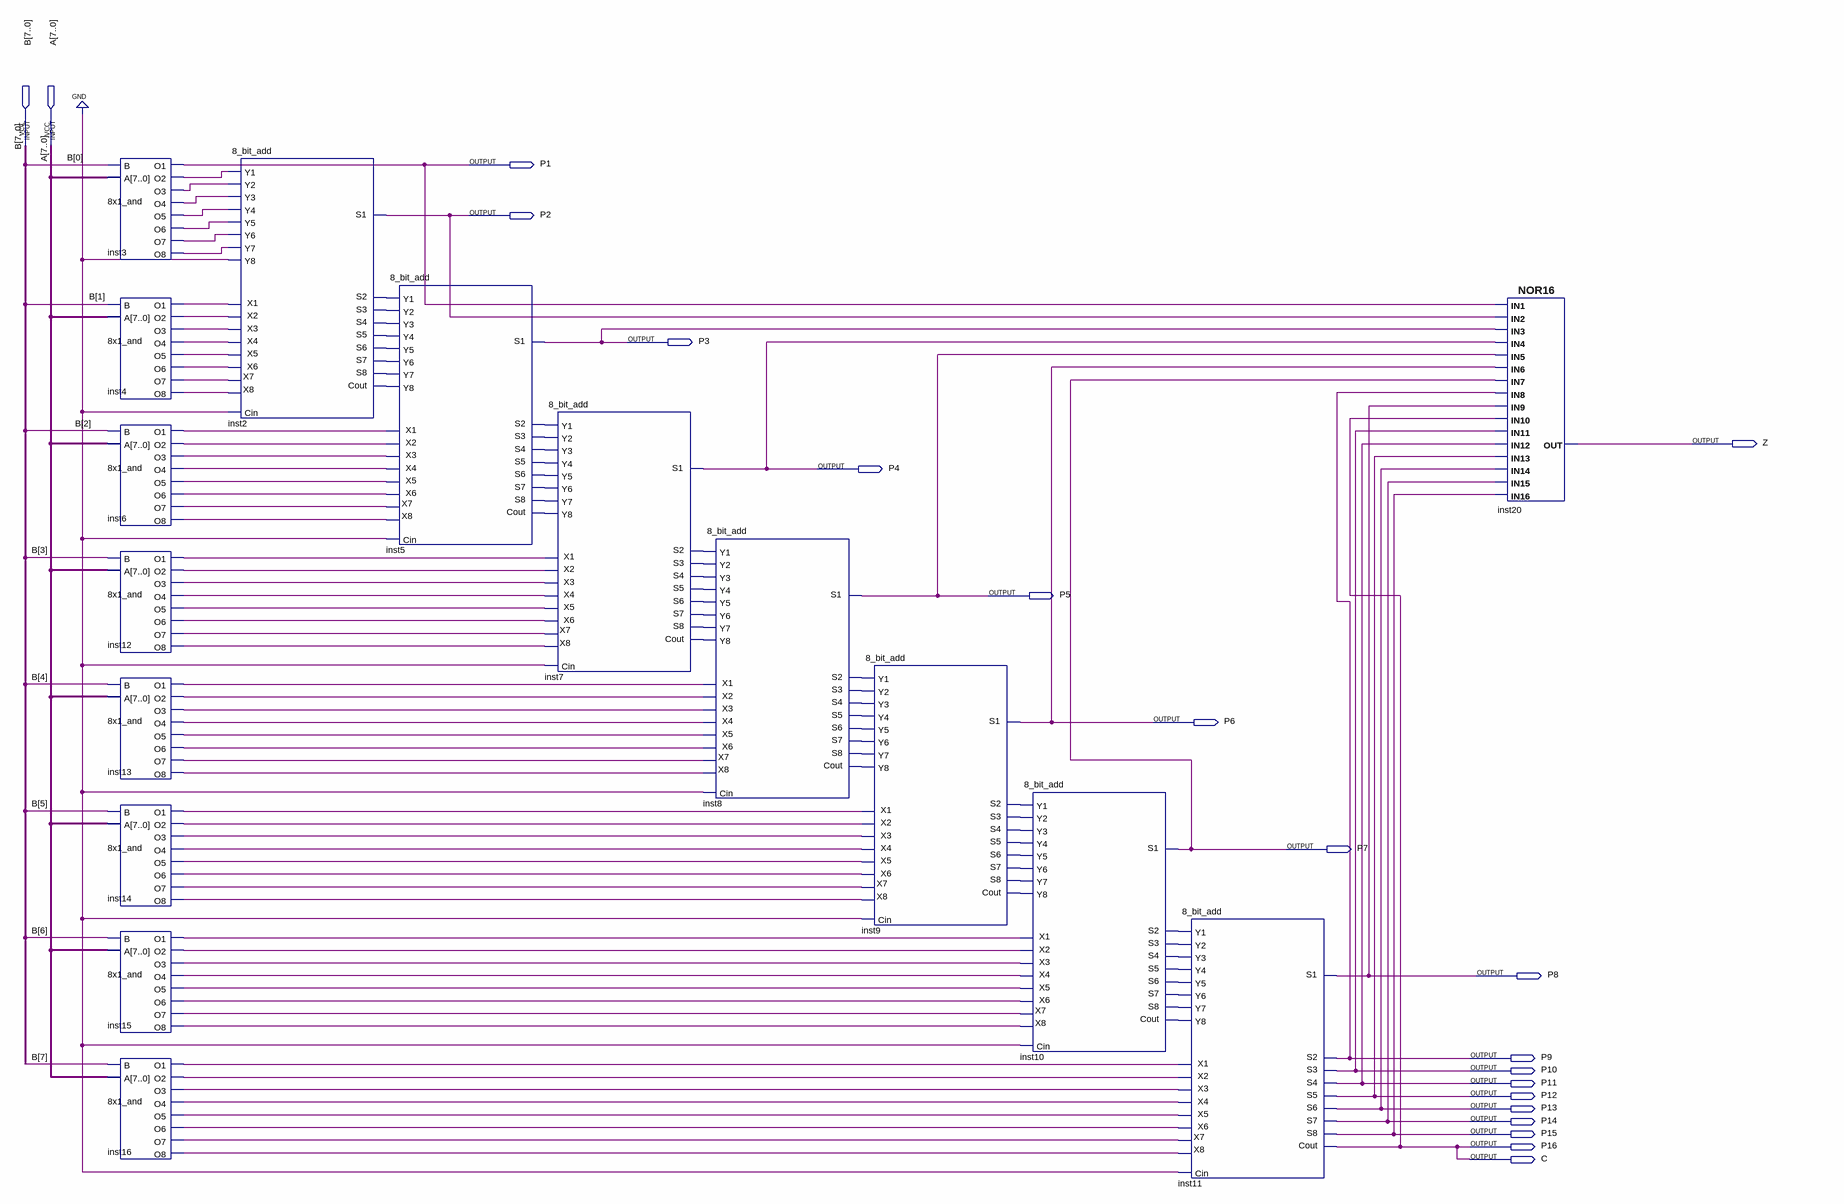
[diagram p0: schematic sheet]
// Quartus schematic MUL_Unsigned.bdf as structural Verilog: 16 symbols, 20 pins
module MUL_Unsigned (
  input  [7:0] B,
  input  [7:0] A,
  output P1,
  output P2,
  output P3,
  output Z,
  output P4,
  output P5,
  output P6,
  output P7,
  output P8,
  output P9,
  output P10,
  output P11,
  output P12,
  output P13,
  output P14,
  output P15,
  output P16,
  output C
);

  wire inst2_cout, inst2_s2, inst2_s3, inst2_s4, inst2_s5, inst2_s6, inst2_s7, inst2_s8, inst3_o2, inst3_o3,
       inst3_o4, inst3_o5, inst3_o6, inst3_o7, inst3_o8, inst4_o1, inst4_o2, inst4_o3, inst4_o4, inst4_o5,
       inst4_o6, inst4_o7, inst4_o8, inst5_cout, inst5_s2, inst5_s3, inst5_s4, inst5_s5, inst5_s6, inst5_s7,
       inst5_s8, inst6_o1, inst6_o2, inst6_o3, inst6_o4, inst6_o5, inst6_o6, inst6_o7, inst6_o8, inst7_cout,
       inst7_s2, inst7_s3, inst7_s4, inst7_s5, inst7_s6, inst7_s7, inst7_s8, inst8_cout, inst8_s2, inst8_s3,
       inst8_s4, inst8_s5, inst8_s6, inst8_s7, inst8_s8, inst9_cout, inst9_s2, inst9_s3, inst9_s4, inst9_s5,
       inst9_s6, inst9_s7, inst9_s8, inst10_cout, inst10_s2, inst10_s3, inst10_s4, inst10_s5, inst10_s6,
       inst10_s7, inst10_s8, inst12_o1, inst12_o2, inst12_o3, inst12_o4, inst12_o5, inst12_o6, inst12_o7,
       inst12_o8, inst13_o1, inst13_o2, inst13_o3, inst13_o4, inst13_o5, inst13_o6, inst13_o7, inst13_o8,
       inst14_o1, inst14_o2, inst14_o3, inst14_o4, inst14_o5, inst14_o6, inst14_o7, inst14_o8, inst15_o1,
       inst15_o2, inst15_o3, inst15_o4, inst15_o5, inst15_o6, inst15_o7, inst15_o8, inst16_o1, inst16_o2,
       inst16_o3, inst16_o4, inst16_o5, inst16_o6, inst16_o7, inst16_o8;

  \8x1_and  inst3 (
    .B(B[0]), .A(A), .O1(P1), .O2(inst3_o2), .O3(inst3_o3), .O4(inst3_o4), .O5(inst3_o5), .O6(inst3_o6),
    .O7(inst3_o7), .O8(inst3_o8));
  \8x1_and  inst4 (
    .B(B[1]), .A(A), .O1(inst4_o1), .O2(inst4_o2), .O3(inst4_o3), .O4(inst4_o4), .O5(inst4_o5),
    .O6(inst4_o6), .O7(inst4_o7), .O8(inst4_o8));
  \8x1_and  inst6 (
    .B(B[2]), .A(A), .O1(inst6_o1), .O2(inst6_o2), .O3(inst6_o3), .O4(inst6_o4), .O5(inst6_o5),
    .O6(inst6_o6), .O7(inst6_o7), .O8(inst6_o8));
  \8x1_and  inst12 (
    .B(B[3]), .A(A), .O1(inst12_o1), .O2(inst12_o2), .O3(inst12_o3), .O4(inst12_o4), .O5(inst12_o5),
    .O6(inst12_o6), .O7(inst12_o7), .O8(inst12_o8));
  \8x1_and  inst13 (
    .B(B[4]), .A(A), .O1(inst13_o1), .O2(inst13_o2), .O3(inst13_o3), .O4(inst13_o4), .O5(inst13_o5),
    .O6(inst13_o6), .O7(inst13_o7), .O8(inst13_o8));
  \8x1_and  inst14 (
    .B(B[5]), .A(A), .O1(inst14_o1), .O2(inst14_o2), .O3(inst14_o3), .O4(inst14_o4), .O5(inst14_o5),
    .O6(inst14_o6), .O7(inst14_o7), .O8(inst14_o8));
  \8x1_and  inst15 (
    .B(B[6]), .A(A), .O1(inst15_o1), .O2(inst15_o2), .O3(inst15_o3), .O4(inst15_o4), .O5(inst15_o5),
    .O6(inst15_o6), .O7(inst15_o7), .O8(inst15_o8));
  \8x1_and  inst16 (
    .B(B[7]), .A(A), .O1(inst16_o1), .O2(inst16_o2), .O3(inst16_o3), .O4(inst16_o4), .O5(inst16_o5),
    .O6(inst16_o6), .O7(inst16_o7), .O8(inst16_o8));
  \8_bit_add  inst2 (
    .Y1(inst3_o2), .X1(inst4_o1), .X2(inst4_o2), .X3(inst4_o3), .X4(inst4_o4), .Y2(inst3_o3), .Y3(inst3_o4),
    .Y4(inst3_o5), .X5(inst4_o5), .Y5(inst3_o6), .X6(inst4_o6), .Y6(inst3_o7), .X7(inst4_o7), .Y7(inst3_o8),
    .X8(inst4_o8), .Y8(1'b0), .Cin(1'b0), .Cout(inst2_cout), .S1(P2), .S2(inst2_s2), .S3(inst2_s3),
    .S4(inst2_s4), .S5(inst2_s5), .S6(inst2_s6), .S7(inst2_s7), .S8(inst2_s8));
  \8_bit_add  inst5 (
    .Y1(inst2_s2), .X1(inst6_o1), .X2(inst6_o2), .X3(inst6_o3), .X4(inst6_o4), .Y2(inst2_s3), .Y3(inst2_s4),
    .Y4(inst2_s5), .X5(inst6_o5), .Y5(inst2_s6), .X6(inst6_o6), .Y6(inst2_s7), .X7(inst6_o7), .Y7(inst2_s8),
    .X8(inst6_o8), .Y8(inst2_cout), .Cin(1'b0), .Cout(inst5_cout), .S1(P3), .S2(inst5_s2), .S3(inst5_s3),
    .S4(inst5_s4), .S5(inst5_s5), .S6(inst5_s6), .S7(inst5_s7), .S8(inst5_s8));
  \8_bit_add  inst7 (
    .Y1(inst5_s2), .X1(inst12_o1), .X2(inst12_o2), .X3(inst12_o3), .X4(inst12_o4), .Y2(inst5_s3),
    .Y3(inst5_s4), .Y4(inst5_s5), .X5(inst12_o5), .Y5(inst5_s6), .X6(inst12_o6), .Y6(inst5_s7),
    .X7(inst12_o7), .Y7(inst5_s8), .X8(inst12_o8), .Y8(inst5_cout), .Cin(1'b0), .Cout(inst7_cout), .S1(P4),
    .S2(inst7_s2), .S3(inst7_s3), .S4(inst7_s4), .S5(inst7_s5), .S6(inst7_s6), .S7(inst7_s7), .S8(inst7_s8));
  \8_bit_add  inst8 (
    .Y1(inst7_s2), .X1(inst13_o1), .X2(inst13_o2), .X3(inst13_o3), .X4(inst13_o4), .Y2(inst7_s3),
    .Y3(inst7_s4), .Y4(inst7_s5), .X5(inst13_o5), .Y5(inst7_s6), .X6(inst13_o6), .Y6(inst7_s7),
    .X7(inst13_o7), .Y7(inst7_s8), .X8(inst13_o8), .Y8(inst7_cout), .Cin(1'b0), .Cout(inst8_cout), .S1(P5),
    .S2(inst8_s2), .S3(inst8_s3), .S4(inst8_s4), .S5(inst8_s5), .S6(inst8_s6), .S7(inst8_s7), .S8(inst8_s8));
  \8_bit_add  inst9 (
    .Y1(inst8_s2), .X1(inst14_o1), .X2(inst14_o2), .X3(inst14_o3), .X4(inst14_o4), .Y2(inst8_s3),
    .Y3(inst8_s4), .Y4(inst8_s5), .X5(inst14_o5), .Y5(inst8_s6), .X6(inst14_o6), .Y6(inst8_s7),
    .X7(inst14_o7), .Y7(inst8_s8), .X8(inst14_o8), .Y8(inst8_cout), .Cin(1'b0), .Cout(inst9_cout), .S1(P6),
    .S2(inst9_s2), .S3(inst9_s3), .S4(inst9_s4), .S5(inst9_s5), .S6(inst9_s6), .S7(inst9_s7), .S8(inst9_s8));
  \8_bit_add  inst10 (
    .Y1(inst9_s2), .X1(inst15_o1), .X2(inst15_o2), .X3(inst15_o3), .X4(inst15_o4), .Y2(inst9_s3),
    .Y3(inst9_s4), .Y4(inst9_s5), .X5(inst15_o5), .Y5(inst9_s6), .X6(inst15_o6), .Y6(inst9_s7),
    .X7(inst15_o7), .Y7(inst9_s8), .X8(inst15_o8), .Y8(inst9_cout), .Cin(1'b0), .Cout(inst10_cout), .S1(P7),
    .S2(inst10_s2), .S3(inst10_s3), .S4(inst10_s4), .S5(inst10_s5), .S6(inst10_s6), .S7(inst10_s7),
    .S8(inst10_s8));
  \8_bit_add  inst11 (
    .Y1(inst10_s2), .X1(inst16_o1), .X2(inst16_o2), .X3(inst16_o3), .X4(inst16_o4), .Y2(inst10_s3),
    .Y3(inst10_s4), .Y4(inst10_s5), .X5(inst16_o5), .Y5(inst10_s6), .X6(inst16_o6), .Y6(inst10_s7),
    .X7(inst16_o7), .Y7(inst10_s8), .X8(inst16_o8), .Y8(inst10_cout), .Cin(1'b0), .Cout(C), .S1(P8), .S2(P9),
    .S3(P10), .S4(P11), .S5(P12), .S6(P13), .S7(P14), .S8(P15));
  nor inst20 (Z, P1, P2, P3, P4, P5, P6, P7, P9, P8, C, P10, P11, P12, P13, P14, P15);

  assign P16 = C;
endmodule
